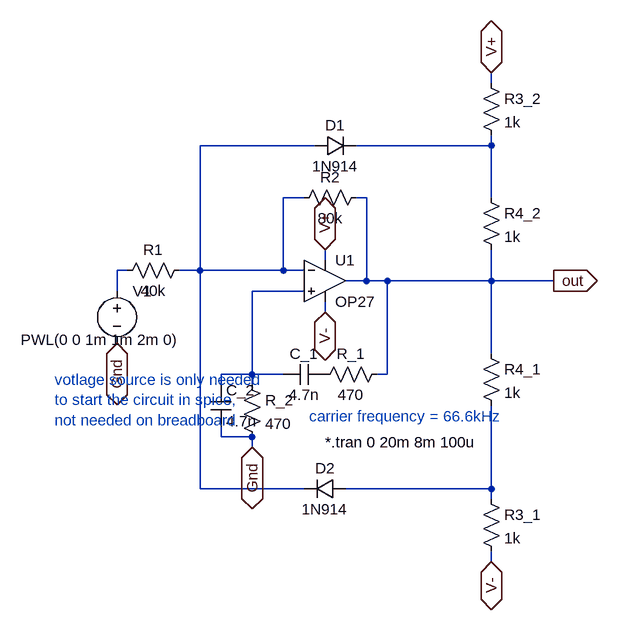
[diagram p0: schematic oscillator_block.asc]
oscillator_block.asc, the LTspice schematic file:
Version 4.1
SHEET 1 948 680
WIRE 480 -144 480 -160
WIRE 208 -48 32 -48
WIRE 480 -48 480 -64
WIRE 480 -48 272 -48
WIRE 192 32 160 32
WIRE 288 32 272 32
WIRE 480 32 480 -48
WIRE 224 128 224 112
WIRE -80 144 -96 144
WIRE 32 144 32 -48
WIRE 32 144 0 144
WIRE 160 144 160 32
WIRE 160 144 32 144
WIRE 192 144 160 144
WIRE 288 160 288 32
WIRE 288 160 256 160
WIRE 320 160 288 160
WIRE 480 160 480 112
WIRE 480 160 320 160
WIRE 576 160 480 160
WIRE -96 176 -96 144
WIRE 192 176 112 176
WIRE 224 208 224 192
WIRE 480 272 480 160
WIRE 112 304 112 176
WIRE 112 304 64 304
WIRE 160 304 112 304
WIRE 320 304 320 160
WIRE 320 304 304 304
WIRE 64 320 64 304
WIRE 112 320 112 304
WIRE 64 400 64 384
WIRE 112 400 64 400
WIRE 112 416 112 400
WIRE 32 480 32 144
WIRE 192 480 32 480
WIRE 480 480 480 352
WIRE 480 480 256 480
WIRE 480 496 480 480
WIRE 480 592 480 576
FLAG 576 160 out
IOPIN 576 160 Out
FLAG 224 112 V+
IOPIN 224 112 BiDir
FLAG 480 -160 V+
IOPIN 480 -160 BiDir
FLAG 224 208 V-
IOPIN 224 208 BiDir
FLAG 480 592 V-
IOPIN 480 592 BiDir
FLAG 112 416 Gnd
IOPIN 112 416 BiDir
FLAG -96 256 Gnd
IOPIN -96 256 BiDir
SYMBOL res -96 160 R270
WINDOW 0 32 56 VTop 2
WINDOW 3 0 56 VBottom 2
SYMATTR InstName R1
SYMATTR Value 40k
SYMBOL res 176 48 R270
WINDOW 0 32 56 VTop 2
WINDOW 3 0 56 VBottom 2
SYMATTR InstName R2
SYMATTR Value 80k
SYMBOL cap 160 320 R270
WINDOW 0 32 32 VTop 2
WINDOW 3 0 32 VBottom 2
SYMATTR InstName C_1
SYMATTR Value 4.7n
SYMBOL res 208 320 R270
WINDOW 0 32 56 VTop 2
WINDOW 3 0 56 VBottom 2
SYMATTR InstName R_1
SYMATTR Value 470
SYMBOL res 96 304 R0
SYMATTR InstName R_2
SYMATTR Value 470
SYMBOL cap 48 320 R0
SYMATTR InstName C_2
SYMATTR Value 4.7n
SYMBOL diode 208 -32 R270
WINDOW 0 32 32 VTop 2
WINDOW 3 0 32 VBottom 2
SYMATTR InstName D1
SYMATTR Value 1N914
SYMBOL diode 256 464 R90
WINDOW 0 0 32 VBottom 2
WINDOW 3 32 32 VTop 2
SYMATTR InstName D2
SYMATTR Value 1N914
SYMBOL voltage -96 160 R0
WINDOW 3 -148 91 Left 2
WINDOW 123 0 0 Left 0
WINDOW 39 0 0 Left 0
SYMATTR Value PWL(0 0 1m 1m 2m 0)
SYMATTR InstName V1
SYMBOL res 464 -160 R0
SYMATTR InstName R3_2
SYMATTR Value 1k
SYMBOL res 464 16 R0
SYMATTR InstName R4_2
SYMATTR Value 1k
SYMBOL res 464 256 R0
SYMATTR InstName R4_1
SYMATTR Value 1k
SYMBOL res 464 480 R0
SYMATTR InstName R3_1
SYMATTR Value 1k
SYMBOL OpAmps\\OP27 224 96 R0
SYMATTR InstName U1
TEXT -192 312 Left 2 ;votlage source is only needed \nto start the circuit in spice, \nnot needed on breadboard
TEXT 224 408 Left 2 !*.tran 0 20m 8m 100u
TEXT 200 368 Left 2 ;carrier frequency = 66.6kHz

The netlist it stands for:
* oscillator_block.asc
R1 N003 N001 40k
R2 N001 out 80k
C_1 N004 P001 4.7n
R_1 P001 out 470
R_2 N004 Gnd 470
C_2 N004 Gnd 4.7n
D1 N001 N002 1N914
D2 N005 N001 1N914
V1 N003 Gnd PWL(0 0 1m 1m 2m 0)
R3_2 V+ N002 1k
R4_2 N002 out 1k
R4_1 out N005 1k
R3_1 N005 V- 1k
X§U1 N004 N001 V+ V- out OP27  ; pins In+ In- V+ V- OUT
.model D D
.lib standard.dio
* votlage source is only needed
* to start the circuit in spice,
* not needed on breadboard
*.tran 0 20m 8m 100u
* carrier frequency = 66.6kHz
.lib ADI.lib
.backanno
.end